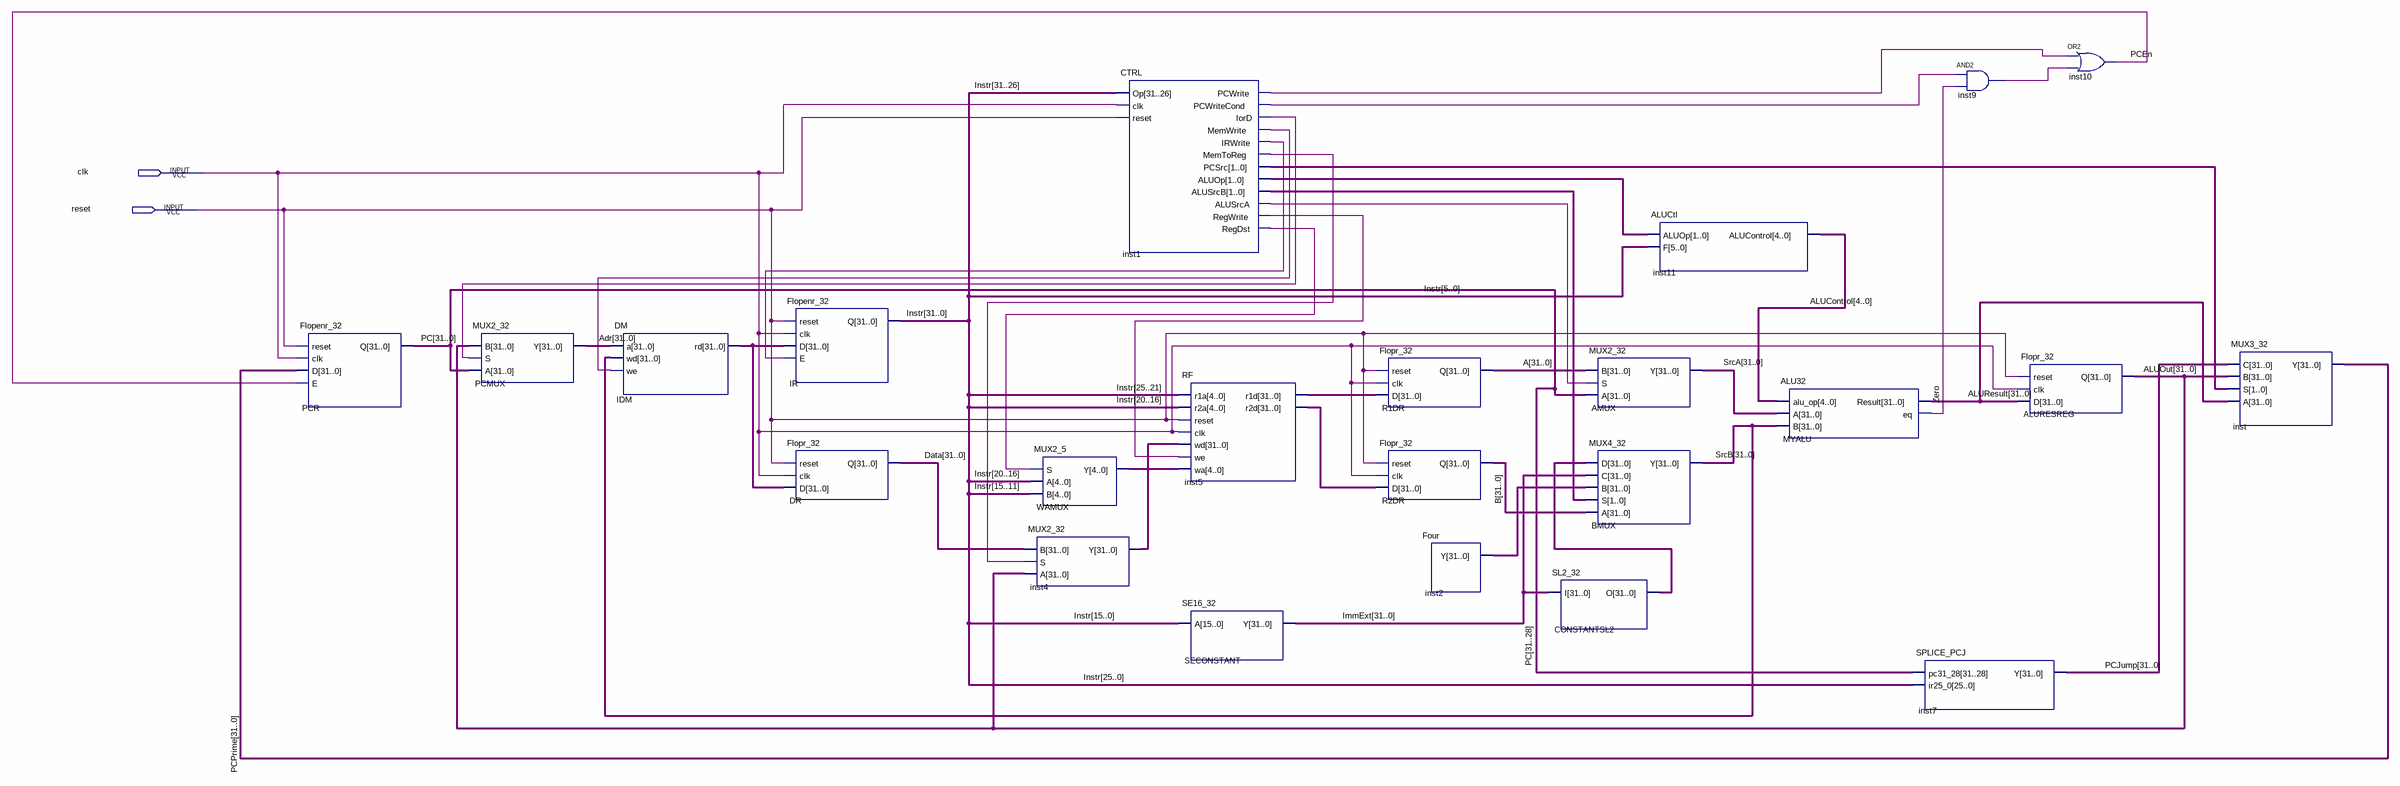
[diagram p0: schematic sheet]
// Quartus schematic CPU_MultiCycle.bdf as structural Verilog: 23 symbols, 2 pins
module CPU_MultiCycle (
  input  clk,
  input  reset
);

  wire inst1_alusrca, inst1_iord, inst1_irwrite, inst1_memtoreg, inst1_memwrite, inst1_pcwrite,
       inst1_pcwritecond, inst1_regdst, inst1_regwrite, inst9_out, PCEn, Zero;
  wire [1:0] inst1_aluop, inst1_alusrcb, inst1_pcsrc;
  wire [4:0] ALUControl, WAMUX_y;
  wire [31:0] A, Adr, ALUOut, ALUResult, B, CONSTANTSL2_o, Data, IDM_rd, ImmExt, inst2_y, inst4_y, inst5_r1d,
       inst5_r2d, Instr, PC, PCJump, PCPrime, SrcA, SrcB;

  Flopenr_32 PCR (.reset(reset), .clk(clk), .D(PCPrime), .E(PCEn), .Q(PC));
  MUX2_32 PCMUX (.B(ALUOut), .S(inst1_iord), .A(PC), .Y(Adr));
  DM IDM (.a(Adr), .wd(SrcB), .we(inst1_memwrite), .rd(IDM_rd));
  Flopenr_32 IR (.reset(reset), .clk(clk), .D(IDM_rd), .E(inst1_irwrite), .Q(Instr));
  Flopr_32 DR (.reset(reset), .clk(clk), .D(IDM_rd), .Q(Data));
  MUX2_5 WAMUX (.S(inst1_regdst), .A(Instr[20:16]), .B(Instr[15:11]), .Y(WAMUX_y));
  MUX2_32 inst4 (.B(Data), .S(inst1_memtoreg), .A(ALUOut), .Y(inst4_y));
  CTRL inst1 (
    .Op(Instr[31:26]), .clk(clk), .reset(reset), .PCWrite(inst1_pcwrite), .PCWriteCond(inst1_pcwritecond),
    .IorD(inst1_iord), .MemWrite(inst1_memwrite), .IRWrite(inst1_irwrite), .MemToReg(inst1_memtoreg),
    .PCSrc(inst1_pcsrc), .ALUOp(inst1_aluop), .ALUSrcB(inst1_alusrcb), .ALUSrcA(inst1_alusrca),
    .RegWrite(inst1_regwrite), .RegDst(inst1_regdst));
  RF inst5 (
    .r1a(Instr[25:21]), .r2a(Instr[20:16]), .reset(reset), .clk(clk), .wd(inst4_y), .we(inst1_regwrite),
    .wa(WAMUX_y), .r1d(inst5_r1d), .r2d(inst5_r2d));
  SE16_32 SECONSTANT (.A(Instr[15:0]), .Y(ImmExt));
  Flopr_32 R1DR (.reset(reset), .clk(clk), .D(inst5_r1d), .Q(A));
  Flopr_32 R2DR (.reset(reset), .clk(clk), .D(inst5_r2d), .Q(B));
  Four inst2 (.Y(inst2_y));
  SL2_32 CONSTANTSL2 (.I(ImmExt), .O(CONSTANTSL2_o));
  MUX2_32 AMUX (.B(A), .S(inst1_alusrca), .A(PC), .Y(SrcA));
  MUX4_32 BMUX (.D(CONSTANTSL2_o), .C(ImmExt), .B(inst2_y), .S(inst1_alusrcb), .A(B), .Y(SrcB));
  ALUCtl inst11 (.ALUOp(inst1_aluop), .F(Instr[5:0]), .ALUControl(ALUControl));
  ALU32 MYALU (.alu_op(ALUControl), .A(SrcA), .B(SrcB), .Result(ALUResult), .eq(Zero));
  SPLICE_PCJ inst7 (.pc31_28(PC[31:28]), .ir25_0(Instr[25:0]), .Y(PCJump));
  and inst9 (inst9_out, inst1_pcwritecond, Zero);
  Flopr_32 ALURESREG (.reset(reset), .clk(clk), .D(ALUResult), .Q(ALUOut));
  or inst10 (PCEn, inst1_pcwrite, inst9_out);
  MUX3_32 inst (.C(PCJump), .B(ALUOut), .S(inst1_pcsrc), .A(ALUResult), .Y(PCPrime));
endmodule
